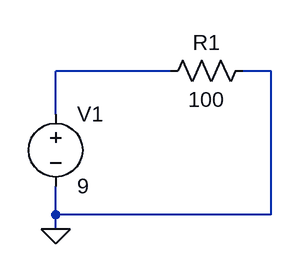
[diagram p0: schematic Lab1_1_100.asc]
Lab1_1_100.asc, the LTspice schematic file:
Version 4
SHEET 1 880 680
WIRE 176 96 48 96
WIRE 288 96 256 96
WIRE 48 144 48 96
WIRE 48 256 48 224
WIRE 288 256 288 96
WIRE 288 256 48 256
WIRE 48 272 48 256
FLAG 48 272 0
SYMBOL voltage 48 128 R0
WINDOW 123 0 0 Left 0
WINDOW 39 0 0 Left 0
SYMATTR InstName V1
SYMATTR Value 9
SYMBOL res 272 80 R90
WINDOW 0 0 56 VBottom 2
WINDOW 3 32 56 VTop 2
SYMATTR InstName R1
SYMATTR Value 100

The netlist it stands for:
* Lab1_1_100.asc
V1 N001 0 9
R1 0 N001 100
.backanno
.end